# Altium project PCB_Project.PrjPcb
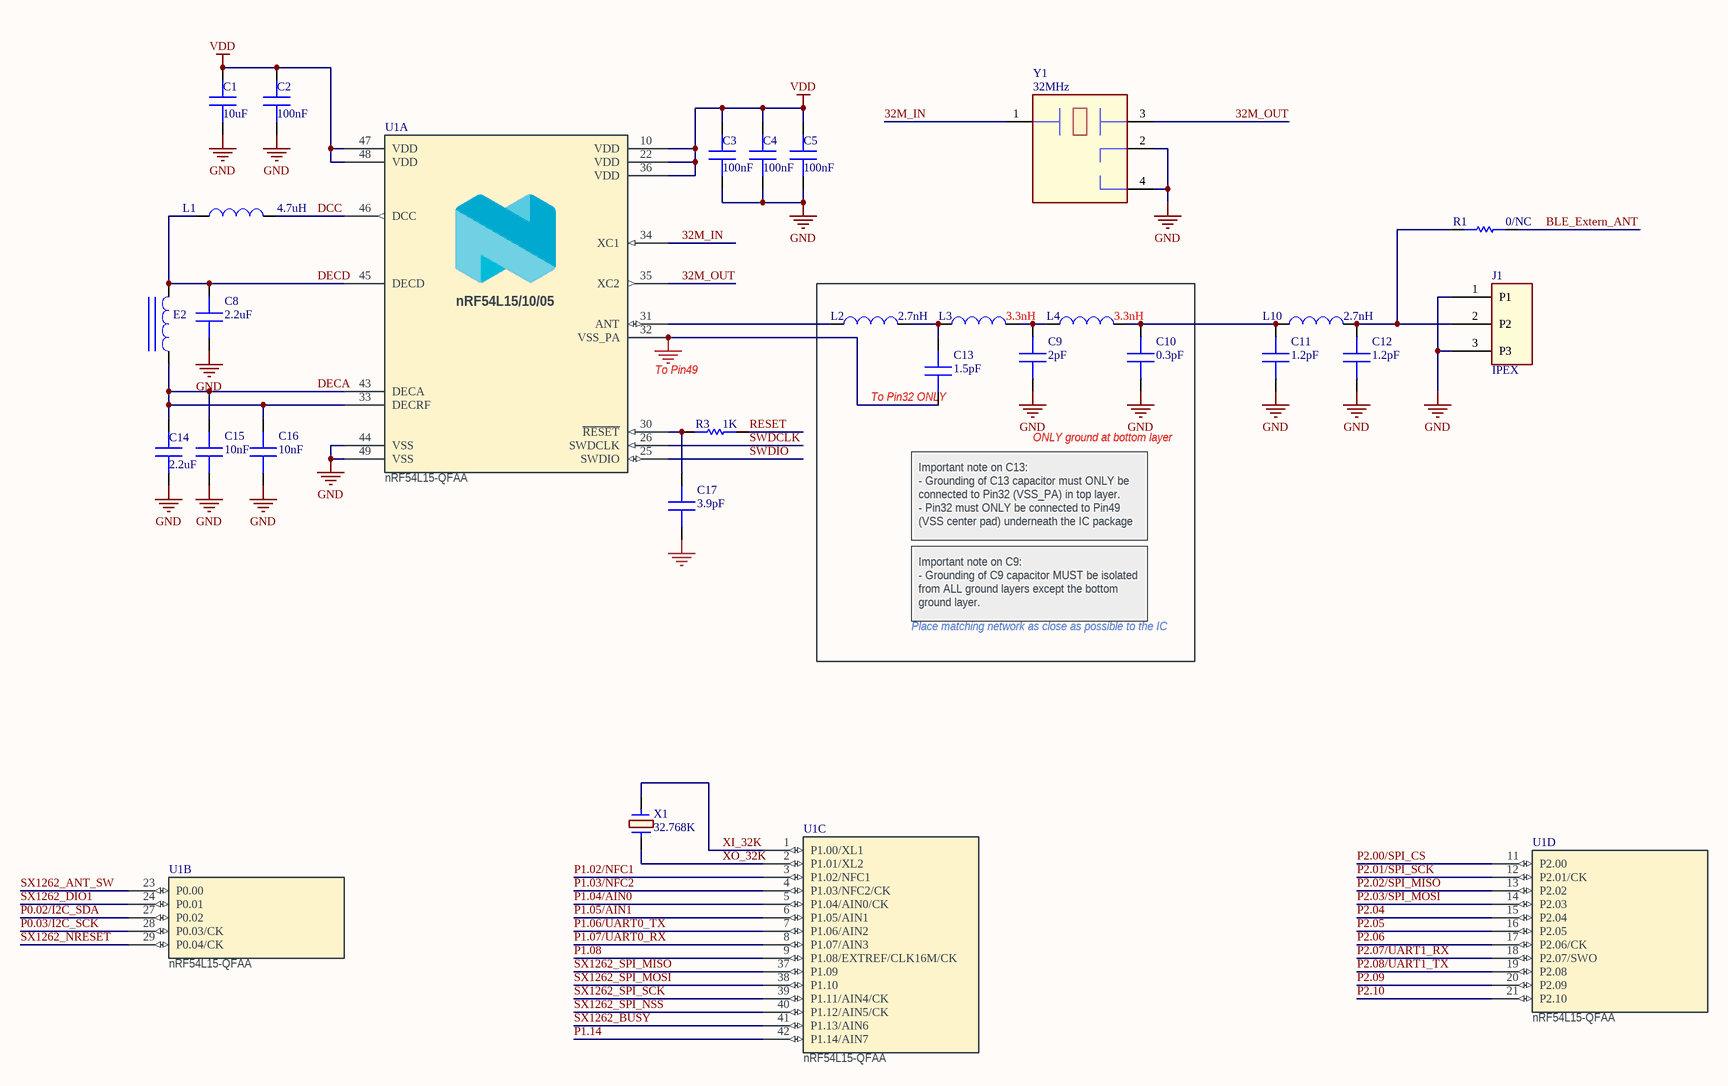
[diagram p0: RAK3162_NRF54L15.SchDoc]
3 sheets, 68 parts. Net scope: global (net labels, ports and power ports of the same name join across sheets).
Board file: RAK3162_260121_1.PcbDoc
Sheets:
  RAK3162_NRF54L15.SchDoc
  RAK3162_Pinout.SchDoc
  RAK3162_SX1262.SchDoc

## Sheet RAK3162_NRF54L15.SchDoc
size A3; SheetNumber: 1; SheetTotal: 3; PCBA_CODE: 8262XXXX

### Parts
C1  value 10uF  [sc0402]  (hidden comment: CAPACITOR NP)
C2  value 100nF  [sc0201]  (hidden comment: CAPACITOR NP)
C3  value 100nF  [sc0201]  (hidden comment: CAPACITOR NP)
C4  value 100nF  [sc0201]  (hidden comment: CAPACITOR NP)
C5  value 100nF  [sc0201]  (hidden comment: CAPACITOR NP)
C8  value 2.2uF  [sc0201]  (hidden comment: CAPACITOR NP)
C9  value 2pF  [sc0201]  (hidden comment: CAPACITOR NP)
C10  value 0.3pF  [sc0201]  (hidden comment: CAPACITOR NP)
C11  value 1.2pF  [sc0201]  (hidden comment: CAPACITOR NP)
C12  value 1.2pF  [sc0201]  (hidden comment: CAPACITOR NP)
C13  value 1.5pF  [sc0201]  (hidden comment: CAPACITOR NP)
C14  value 2.2uF  [sc0201]  (hidden comment: CAPACITOR NP)
C15  value 10nF  [sc0201]  (hidden comment: CAPACITOR NP)
C16  value 10nF  [sc0201]  (hidden comment: CAPACITOR NP)
C17  value 3.9pF  [sc0201]  (hidden comment: CAPACITOR NP)
E2  BEAD  [SL0201]  (value not drawn)
J1  value IPEX  [SCOXSMA_T]  (hidden comment: UFL)
L1  value 4.7uH  [SL0603]  (hidden comment: INDUCTOR)
L2  value 2.7nH  [sl0201]  (hidden comment: INDUCTOR)
L3  value 3.3nH  [sl0201]  (hidden comment: INDUCTOR)
L4  value 3.3nH  [sl0201]  (hidden comment: INDUCTOR)
L10  value 2.7nH  [sl0201]  (hidden comment: INDUCTOR)
R1  value 0/NC  [sr0201]  (hidden comment: RESISTOR)
R3  value 1K  [sr0201]  (hidden comment: RESISTOR)
U1  nRF54L15-QFAA  [QFN40P600X600X90-48N]  (parts A,B,C,D of 4)
X1  32.768K  [CM212H]
Y1  value 32MHz  [S0SC4-2016]  (hidden comment: CRYSTAL_4P)

### Nets
GND: C1.1(POS) C2.1(POS) C3.1(POS) C4.1(POS) C5.1(POS) C8.1(POS) C9.1(POS) C10.1(POS) C11.1(POS) C12.1(POS) C13.1(POS) C14.1(POS) C15.1(POS) C16.1(POS) C17.1(POS) J1.1(P1) J1.3(P3) U1.32(VSS_PA) U1.44(VSS) U1.49(VSS) Y1.2(GND1) Y1.4(GND2)
VDD: C1.2(NEG) C2.2(NEG) C3.2(NEG) C4.2(NEG) C5.2(NEG) U1.10(VDD) U1.22(VDD) U1.36(VDD) U1.47(VDD) U1.48(VDD)
32M_IN: U1.34(XC1) Y1.1(H1)
32M_OUT: U1.35(XC2) Y1.3(H2)
BLE_Extern_ANT: R1.1
DCC: L1.2 U1.46(DCC)
DECA: C14.2(NEG) C15.2(NEG) C16.2(NEG) E2.1 U1.33(DECRF) U1.43(DECA)
DECD: C8.2(NEG) E2.2 L1.1 U1.45(DECD)
P0.02/I2C_SDA: U1.27(P0.02)
P0.03/I2C_SCK: U1.28(P0.03/CK)
P1.02/NFC1: U1.3(P1.02/NFC1)
P1.03/NFC2: U1.4(P1.03/NFC2/CK)
P1.04/AIN0: U1.5(P1.04/AIN0/CK)
P1.05/AIN1: U1.6(P1.05/AIN1)
P1.06/UART0_TX: U1.7(P1.06/AIN2)
P1.07/UART0_RX: U1.8(P1.07/AIN3)
P1.08: U1.9(P1.08/EXTREF/CLK16M/CK)
P1.14: U1.42(P1.14/AIN7)
P2.00/SPI_CS: U1.11(P2.00)
P2.01/SPI_SCK: U1.12(P2.01/CK)
P2.02/SPI_MISO: U1.13(P2.02)
P2.03/SPI_MOSI: U1.14(P2.03)
P2.04: U1.15(P2.04)
P2.05: U1.16(P2.05)
P2.06: U1.17(P2.06/CK)
P2.07/UART1_RX: U1.18(P2.07/SWO)
P2.08/UART1_TX: U1.19(P2.08)
P2.09: U1.20(P2.09)
P2.10: U1.21(P2.10)
RESET: R3.1
SWDCLK: U1.26(SWDCLK)
SWDIO: U1.25(SWDIO)
SX1262_ANT_SW: U1.23(P0.00)
SX1262_BUSY: U1.41(P1.13/AIN6)
SX1262_DIO1: U1.24(P0.01)
SX1262_NRESET: U1.29(P0.04/CK)
SX1262_SPI_MISO: U1.37(P1.09)
SX1262_SPI_MOSI: U1.38(P1.10)
SX1262_SPI_NSS: U1.40(P1.12/AIN5/CK)
SX1262_SPI_SCK: U1.39(P1.11/AIN4/CK)
XI_32K: U1.1(P1.00/XL1) X1.2
XO_32K: U1.2(P1.01/XL2) X1.1
NetC9_2: C9.2(NEG) L3.2 L4.1
NetC10_2: C10.2(NEG) C11.2(NEG) L4.2 L10.1
NetC12_2: C12.2(NEG) J1.2(P2) L10.2 R1.2
NetC13_2: C13.2(NEG) L2.2 L3.1
NetC17_2: C17.2(NEG) R3.2 U1.30(~{RESET})
NetL2_1: L2.1 U1.31(ANT)

### Notes on the sheet
- (near U1) To Pin49
- (near C13) To Pin32 ONLY
- ONLY ground at bottom layer
- Important note on C13:
  - Grounding of C13 capacitor must ONLY be connected to Pin32 (VSS_PA) in top layer.
  - Pin32 must ONLY be connected to Pin49 (VSS center pad) underneath the IC package
- Important note on C9:
  - Grounding of C9 capacitor MUST be isolated from ALL ground layers except the bottom ground layer.
- Place matching network as close as possible to the IC
- Title
- Size:
- Engineer:
- A3
- Revision:
- Date:
- Sheet
- of
- (in symbol nRF54L15-QFAA, part A) nRF54L15/10/05

### Library data of the parts
C1 = 0807C004: Capacitor-10V-10uF-±20%-X5R-0402; MANUFACTURER: YAGEO; Part Number: CC0402MRX5R6BB106; TOLERANCE: ±20%; SYMNAME: CAP; VOLTAGE: 10V; RAK Code: KRAKBJ0807C004; Classification: SMD Ceramic Capacitor; CODE: 0807C004
C2-C5 = 0807B00F: Capacitor-6.3V-100nF-±10%-X5R-0201; MANUFACTURER: YAGEO; Part Number: CC0201KRX5R5BB104; TOLERANCE: ±10%; SYMNAME: CAP; VOLTAGE: 6.3V; RAK Code: K3CA10402KA201; Classification: SMD Ceramic Capacitor; CODE: 0807B00F
C8 C14 = 0807C02F: Capacitor-6.3V-2.2uF-±20%-X5R-0201; MANUFACTURER: YAGEO; Part Number: CC0201MRX5R5BB225; TOLERANCE: ±20%; SYMNAME: CAP; VOLTAGE: 6.3V; RAK Code: KRAKBJ0807C02F; Classification: SMD Ceramic Capacitor; CODE: 0807C02F
C9 = 0807C02M: Capacitor-50V-2pF-±0.1pF-COG-0201; MANUFACTURER: 深圳市宇阳科技发展有限公司; Part Number: C0201COG2R0B500NTA; TOLERANCE: ±0.1pF; SYMNAME: CAP; VOLTAGE: 50V; Classification: SMD Ceramic Capacitor; CODE: 0807C02M
C10 = 0807B00M: Capacitor-50V-0.3pF-±0.1pF-NPO-0201; MANUFACTURER: YAGEO; Part Number: CC0201BRNPO9BNR30; TOLERANCE: ±0.1pF; SYMNAME: CAP; VOLTAGE: 50V; RAK Code: KRAKBJ0807B00M; Classification: SMD Ceramic Capacitor; CODE: 0807B00M
C11 C12 = 0807B00L: Capacitor-50V-1.2pF-±0.1pF-COG-0201; MANUFACTURER: MuRATA; Part Number: GRM0335C1H1R2BA01D; TOLERANCE: ±0.1pF; SYMNAME: CAP; VOLTAGE: 50V; RAK Code: KRAKBJ0807B00L; Classification: SMD Ceramic Capacitor; CODE: 0807B00L
C13 = 0807B00Q: Capacitor-50V-1.5pF-±0.25pF-COG-0201; MANUFACTURER: YAGEO; Part Number: CC0201CRNPO9BN1R5; TOLERANCE: ±0.25pF; SYMNAME: CAP; VOLTAGE: 50V; RAK Code: KRAKBJ0807B00Q; Classification: SMD Ceramic Capacitor; CODE: 0807B00Q
C15 C16 = 0807B00H: Capacitor-10V-10nF-±10%-X7R-0201; MANUFACTURER: YAGEO; Part Number: CC0201KRX7R6BB103; TOLERANCE: ±10%; SYMNAME: CAP; VOLTAGE: 10V; RAK Code: K3CA10303KA201; Classification: SMD Ceramic Capacitor; CODE: 0807B00H
C17 = 0807C00E: Capacitor-50V-3.9pF-±0.25pF-NPO-0201; MANUFACTURER: YAGEO; Part Number: CC0201CRNPO9BN3R9; TOLERANCE: ±0.25pF; SYMNAME: CAP; VOLTAGE: 50V; RAK Code: KRAKBJ0807C00E; Classification: SMD Ceramic Capacitor; CODE: 0807C00E
E2 = 1007C00B: EMI Ferrite Bead-240Ω±25%@100MHz-0.38Ω-350mA-0201; MANUFACTURER: Murata; Part Number: BLM03AX241SN1D; Current: 350mA; Value: 0.38ohm; Tolerance: ±25%; CODE: 1007C00B; Classification: Bead
J1 = 1404A001: Coaxial Connectors-IPEX MHF1-Receptacle, Male Pin-50Ohm-Surface Mount; MANUFACTURER: BLDZ01; PART_NUMBER: ECT818000071; Part Number: L10-03001-01; RAK Code: K6PRUFLRSMT101; CODE: 1404A001; Classification: Coaxial Connectors
L1 = 1003C02M: Power Inductor-4.7uH-±20%-0.5Ω-120mA-0603; MANUFACTURER: TDK; Part Number: MLZ1608M4R7WT000; Current: 120mA; Tolerance: ±20%; Classification: SMD Inductor; CODE: 1003C02M
L2 L10 = 1003B00N: Inductor-2.7nH-±0.1nH-0.2Ω-500mA-0201; MANUFACTURER: MURATA; Part Number: LQP03TN2N7B02D; RAK Code: K3LA027A05A201; Tolerance: ±0.1nH; Classification: SMD Inductor; CODE: 1003B00N
L3 L4 = 1003B00E: Inductor-3.3nH-±0.1nH-0.25Ω-450mA-0201; MANUFACTURER: MURATA; Part Number: LQP03TN3N3B02; RAK Code: KRAKBJ1003B00E; Tolerance: ±0.1nH; Classification: SMD Inductor; CODE: 1003B00E
R1 = 0709B00M: Resistor-0Ω-0.5A-50mΩMAX-0201; MANUFACTURER: YAGEO; Part Number: RC0201JR-070RL; RAK Code: K3RS00000JA201; Classification: Thick Film Resistor; CODE: 0709B00M; Tolerance: 50mΩMAX
R3 = 0709B01A: Resistor-1/20W-1KΩ-±1%-0201; MANUFACTURER: YAGEO; Part Number: RC0201FR-071KL; RAK Code: KRAKBJ0709B01A; Tolerance: ±1%; Classification: Thick Film Resistor; CODE: 0709B01A
U1 = nRF54L15-QFAA: Manufacturer: Nordic Semiconductor; Part number NEMS: 102000370; Component Status: Active; Pad Count: 49; Note: N.A.; Part Number: nRF54L15-QFAA; PartId: 102000370; Component Class: Nordic_Devices; Author: stl1; Manufacturer Part Number: nRF54L15-QFAA; ComponentLink1URL: N.A.; ComponentLink1Description: Datasheet; ComponentLink2URL: N.A.; ComponentLink2Description: Supplier link; HelpURL: N.A.; LatestRevisionDate: 2024-11-27; Published: 2024-11-27; Footprint Doc: QFN-48; Supplier 1: Nordic Semiconductor; Supplier Part Number 1: nRF54L15-QFAA; Supplier 2: N.A.; Supplier Part Number 2: N.A.; Artikkelnr Noca: N.A.; Part number IPS: N.A.; Part number Norautron: N.A.; Value: nRF54L15-QFAA
X1 = 1202C005: Crystal-32.768KHz-12.5pF-±20ppm-−40~+85℃-SMD-2012-2pin; Manufacturer: XTCS01; PSpiceTemplate: X^@REFDES %1 %2 @MODEL; RAK Code: KRAKBJ1202C005; Tolerance: ±20ppm; Value: 32.768K; Code: 1202C005; Part Number: CM212H; Classification: Crystal
Y1 = 1202B004: Crystal-32MHz-6pF-±20ppm-70Ω-SMD-2016-4pin; MANUFACTURER: MURATA; Part Number: XRCGB32M000F2P10R0; RAK Code: KRAKBJ1202B004; Tolerance: ±20ppm; CODE: 1202B004; SYMNAME: CRYSTAL_4P; Classification: Crystal

## Sheet RAK3162_Pinout.SchDoc
size A4; SheetNumber: 3; SheetTotal: 3; PCBA_CODE: 8262XXXX
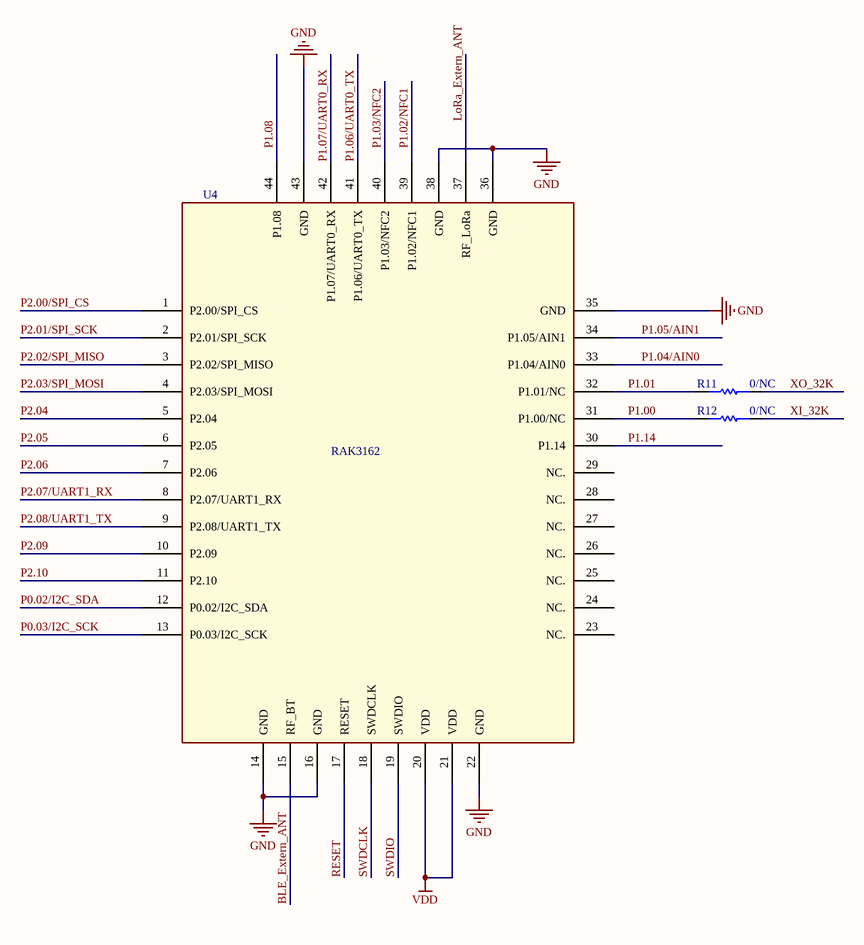
[diagram p1: RAK3162_Pinout.SchDoc]

### Parts
R11  value 0/NC  [sr0201]  (hidden comment: RESISTOR)
R12  value 0/NC  [sr0201]  (hidden comment: RESISTOR)
U4  RAK3162  [RAK4630_PINOUT]

### Nets
GND: U4.14(GND) U4.16(GND) U4.22(GND) U4.35(GND) U4.36(GND) U4.38(GND) U4.43(GND)
VDD: U4.20(VDD) U4.21(VDD)
BLE_Extern_ANT: U4.15(RF_BT)
LoRa_Extern_ANT: U4.37(RF_LoRa)
P0.02/I2C_SDA: U4.12(P0.02/I2C_SDA)
P0.03/I2C_SCK: U4.13(P0.03/I2C_SCK)
P1.00: R12.2 U4.31(P1.00/NC)
P1.01: R11.2 U4.32(P1.01/NC)
P1.02/NFC1: U4.39(P1.02/NFC1)
P1.03/NFC2: U4.40(P1.03/NFC2)
P1.04/AIN0: U4.33(P1.04/AIN0)
P1.05/AIN1: U4.34(P1.05/AIN1)
P1.06/UART0_TX: U4.41(P1.06/UART0_TX)
P1.07/UART0_RX: U4.42(P1.07/UART0_RX)
P1.08: U4.44(P1.08)
P1.14: U4.30(P1.14)
P2.00/SPI_CS: U4.1(P2.00/SPI_CS)
P2.01/SPI_SCK: U4.2(P2.01/SPI_SCK)
P2.02/SPI_MISO: U4.3(P2.02/SPI_MISO)
P2.03/SPI_MOSI: U4.4(P2.03/SPI_MOSI)
P2.04: U4.5(P2.04)
P2.05: U4.6(P2.05)
P2.06: U4.7(P2.06)
P2.07/UART1_RX: U4.8(P2.07/UART1_RX)
P2.08/UART1_TX: U4.9(P2.08/UART1_TX)
P2.09: U4.10(P2.09)
P2.10: U4.11(P2.10)
RESET: U4.17(RESET)
SWDCLK: U4.18(SWDCLK)
SWDIO: U4.19(SWDIO)
XI_32K: R12.1
XO_32K: R11.1

Not connected (* = marked no-connect by the designer): U4 23(NC.) 24(NC.) 25(NC.) 26(NC.) 27(NC.) 28(NC.) 29(NC.)

### Notes on the sheet
- Title
- Size:
- Engineer:
- A4
- Revision:
- Date:
- Sheet
- of

### Library data of the parts
R11 R12 = 0709B00M: as R1 on sheet RAK3162_NRF54L15; CODE: 0709B00M; Tolerance: 50mΩMAX

## Sheet RAK3162_SX1262.SchDoc
size A3; SheetNumber: 2; SheetTotal: 3; PCBA_CODE: 8262XXXX
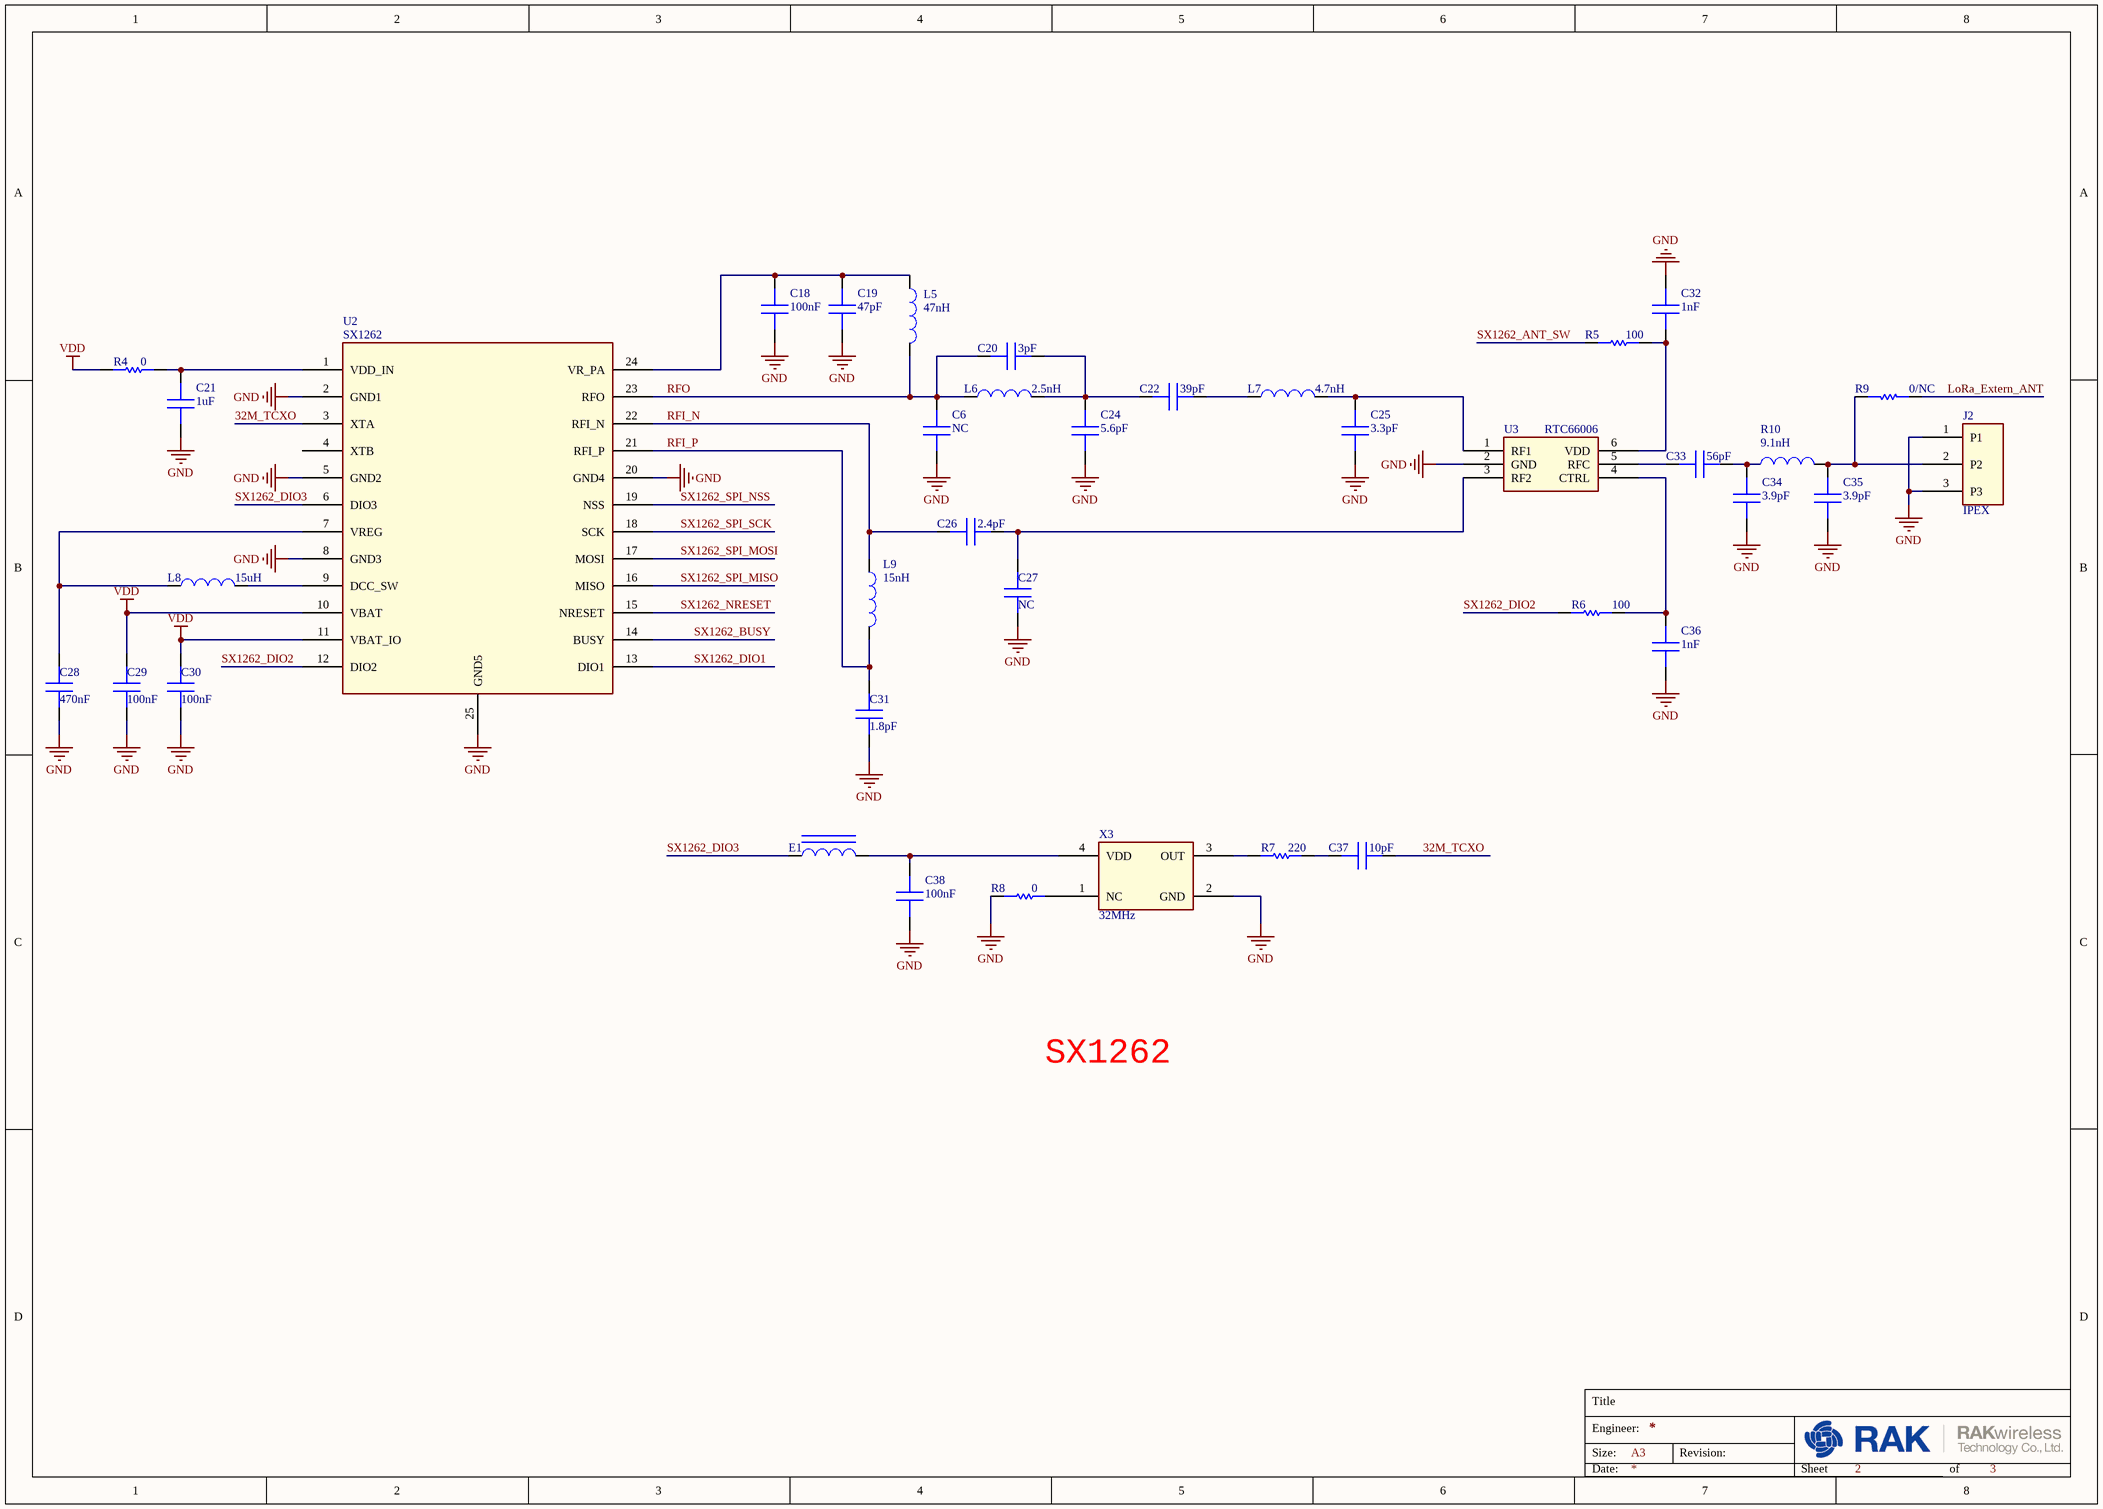
[diagram p2: RAK3162_SX1262.SchDoc]

### Parts
C6  value NC  [sc0201]  (hidden comment: CAPACITOR NP)
C18  value 100nF  [sc0201]  (hidden comment: CAPACITOR NP)
C19  value 47pF  [sc0201]  (hidden comment: CAPACITOR NP)
C20  value 3pF  [sc0201]  (hidden comment: CAPACITOR NP)
C21  value 1uF  [sc0201]  (hidden comment: CAPACITOR NP)
C22  value 39pF  [sc0201]  (hidden comment: CAPACITOR NP)
C24  value 5.6pF  [sc0201]  (hidden comment: CAPACITOR NP)
C25  value 3.3pF  [sc0201]  (hidden comment: CAPACITOR NP)
C26  value 2.4pF  [sc0201]  (hidden comment: CAPACITOR NP)
C27  value NC  [sc0201]  (hidden comment: CAPACITOR NP)
C28  value 470nF  [sc0201]  (hidden comment: CAPACITOR NP)
C29  value 100nF  [sc0201]  (hidden comment: CAPACITOR NP)
C30  value 100nF  [sc0201]  (hidden comment: CAPACITOR NP)
C31  value 1.8pF  [sc0201]  (hidden comment: CAPACITOR NP)
C32  value 1nF  [sc0201]  (hidden comment: CAPACITOR NP)
C33  value 56pF  [sc0201]  (hidden comment: CAPACITOR NP)
C34  value 3.9pF  [sc0201]  (hidden comment: CAPACITOR NP)
C35  value 3.9pF  [sc0201]  (hidden comment: CAPACITOR NP)
C36  value 1nF  [sc0201]  (hidden comment: CAPACITOR NP)
C37  value 10pF  [sc0201]  (hidden comment: CAPACITOR NP)
C38  value 100nF  [sc0201]  (hidden comment: CAPACITOR NP)
E1  BEAD  [SL0201]  (value not drawn)
J2  value IPEX  [SCOXSMA_T]  (hidden comment: UFL)
L5  value 47nH  [SL0402]  (hidden comment: INDUCTOR)
L6  value 2.5nH  [sl0201]  (hidden comment: INDUCTOR)
L7  value 4.7nH  [sl0201]  (hidden comment: INDUCTOR)
L8  value 15uH  [SL0805]  (hidden comment: INDUCTOR)
L9  value 15nH  [sl0201]  (hidden comment: INDUCTOR)
R4  value 0  [sr0201]  (hidden comment: RESISTOR)
R5  value 100  [sr0201]  (hidden comment: RESISTOR)
R6  value 100  [sr0201]  (hidden comment: RESISTOR)
R7  value 220  [sr0201]  (hidden comment: RESISTOR)
R8  value 0  [sr0201]  (hidden comment: RESISTOR)
R9  value 0/NC  [sr0201]  (hidden comment: RESISTOR)
R10  value 9.1nH  [sl0201]  (hidden comment: INDUCTOR)
U2  value SX1262  [VQFN24_4X4MM]  (hidden comment: SX126X)
U3  value RTC66006  [SC-70-6]  (hidden comment: PE4259)
X3  value 32MHz  [S0SC4-2016]  (hidden comment: 32M-TXCO)

### Nets
GND: C6.1(POS) C18.1(POS) C19.1(POS) C21.1(POS) C24.1(POS) C25.1(POS) C27.1(POS) C28.1(POS) C29.1(POS) C30.1(POS) C31.1(POS) C32.2(NEG) C34.1(POS) C35.1(POS) C36.1(POS) C38.1(POS) J2.1(P1) J2.3(P3) R8.2 U2.2(GND1) U2.5(GND2) U2.8(GND3) U2.20(GND4) U2.25(GND5) U3.2(GND) X3.2(GND)
VDD: C29.2(NEG) C30.2(NEG) R4.2 U2.10(VBAT) U2.11(VBAT_IO)
32M_TCXO: C37.2(NEG) U2.3(XTA)
LoRa_Extern_ANT: R9.1
RFI_N: C26.1(POS) L9.1 U2.22(RFI_N)
RFI_P: C31.2(NEG) L9.2 U2.21(RFI_P)
RFO: C6.2(NEG) C20.1(POS) L5.2 L6.1 U2.23(RFO)
SX1262_ANT_SW: R5.2
SX1262_BUSY: U2.14(BUSY)
SX1262_DIO1: U2.13(DIO1)
SX1262_DIO2: R6.2 U2.12(DIO2)
SX1262_DIO3: E1.1 U2.6(DIO3)
SX1262_NRESET: U2.15(NRESET)
SX1262_SPI_MISO: U2.16(MISO)
SX1262_SPI_MOSI: U2.17(MOSI)
SX1262_SPI_NSS: U2.19(NSS)
SX1262_SPI_SCK: U2.18(SCK)
NetC18_2: C18.2(NEG) C19.2(NEG) L5.1 U2.24(VR_PA)
NetC20_2: C20.2(NEG) C22.1(POS) C24.2(NEG) L6.2
NetC21_2: C21.2(NEG) R4.1 U2.1(VDD_IN)
NetC22_2: C22.2(NEG) L7.1
NetC25_2: C25.2(NEG) L7.2 U3.1(RF1)
NetC26_2: C26.2(NEG) C27.2(NEG) U3.3(RF2)
NetC28_2: C28.2(NEG) L8.1 U2.7(VREG)
NetC32_1: C32.1(POS) R5.1 U3.6(VDD)
NetC33_1: C33.1(POS) U3.5(RFC)
NetC33_2: C33.2(NEG) C34.2(NEG) R10.1
NetC35_2: C35.2(NEG) J2.2(P2) R9.2 R10.2
NetC36_2: C36.2(NEG) R6.1 U3.4(CTRL)
NetC37_1: C37.1(POS) R7.1
NetC38_2: C38.2(NEG) E1.2 X3.4(VDD)
NetL8_2: L8.2 U2.9(DCC_SW)
NetR7_2: R7.2 X3.3(OUT)
NetR8_1: R8.1 X3.1(NC)

Not connected (* = marked no-connect by the designer): U2 4(XTB)

### Notes on the sheet
- SX1262
- Title
- Size:
- Engineer:
- A3
- Revision:
- Date:
- Sheet
- of

### Library data of the parts
C6 C24 = 0807C00D: Capacitor-50V-5.6pF-±0.25pF-COG-0201; MANUFACTURER: MURATA; Part Number: GRM0335C1H5R6CA01D; TOLERANCE: ±0.25pF; SYMNAME: CAP; VOLTAGE: 50V; RAK Code: KRAKBJ0807C00D; Classification: SMD Ceramic Capacitor; CODE: 0807C00D
C18 C29 C30 C38 = 0807B00F: as C2 on sheet RAK3162_NRF54L15; CODE: 0807B00F
C19 C27 = 0807C00G: Capacitor-25V-47pF-±5%-NPO-0201; MANUFACTURER: YAGEO; Part Number: CC0201JRNPO8BN470; TOLERANCE: ±5%; SYMNAME: CAP; VOLTAGE: 25V; RAK Code: KRAKBJ0807C00G; Classification: SMD Ceramic Capacitor; CODE: 0807C00G
C20 = 0807C00X: Capacitor-50V-3pF-±0.25pF-NPO-0201; MANUFACTURER: YAGEO; Part Number: CC0201CRNPO9BN3R0; TOLERANCE: ±0.25pF; SYMNAME: CAP; VOLTAGE: 50V; RAK Code: KRAKBJ0807C00X; Classification: SMD Ceramic Capacitor; CODE: 0807C00X
C21 = 0807B00G: Capacitor-6.3V-1uF-±20%-X5R-0201; MANUFACTURER: YAGEO; Part Number: CC0201MRX5R5BB105; TOLERANCE: ±20%; SYMNAME: CAP; VOLTAGE: 6.3V; RAK Code: KRAKBJ0807B00G; Classification: SMD Ceramic Capacitor; CODE: 0807B00G
C22 = 0807C011: Capacitor-25V-39pF-±5%-NPO-0201; MANUFACTURER: YAGEO; Part Number: CC0201JRNPO8BN390; TOLERANCE: ±5%; SYMNAME: CAP; VOLTAGE: 25V; RAK Code: KRAKBJ0807C011; Classification: SMD Ceramic Capacitor; CODE: 0807C011
C25 = 0807B01B: Capacitor-50V-3.3pF-±0.25pF-NPO-0201; MANUFACTURER: YAGEO; Part Number: CC0201CRNPO9BN3R3; TOLERANCE: ±0.25pF; SYMNAME: CAP; VOLTAGE: 50V; RAK Code: KRAKBJ0807B01B; Classification: SMD Ceramic Capacitor; CODE: 0807B01B
C26 = 0807C010: Capacitor-50V-2.4pF-±0.25pF-NPO-0201; MANUFACTURER: YAGEO; Part Number: CC0201CRNPO9BN2R4; TOLERANCE: ±0.25pF; SYMNAME: CAP; VOLTAGE: 50V; RAK Code: KRAKBJ0807C010; Classification: SMD Ceramic Capacitor; CODE: 0807C010
C28 = 0807C02P: Capacitor-6.3V-470nF-±20%-X5R-0201; MANUFACTURER: MURATA; Part Number: GRM033R60J474ME90J; TOLERANCE: ±20%; SYMNAME: CAP; VOLTAGE: 6.3V; Classification: SMD Ceramic Capacitor; CODE: 0807C02P
C31 = 0807B00W: Capacitor-50V-1.8pF-±0.25pF-NPO-0201; MANUFACTURER: YAGEO; Part Number: CC0201CRNPO9BN1R8; TOLERANCE: ±0.25pF; SYMNAME: CAP; VOLTAGE: 50V; RAK Code: K3CA22A06CA201; Classification: SMD Ceramic Capacitor; CODE: 0807B00W
C32 C36 = 0807B00T: Capacitor-25V-1nF-±10%-X7R-0201; MANUFACTURER: YAGEO; Part Number: CC0201KRX7R8BB102; TOLERANCE: ±10%; SYMNAME: CAP; VOLTAGE: 25V; RAK Code: K3CA10204KA201; Classification: SMD Ceramic Capacitor; CODE: 0807B00T
C33 = 0807C02R: Capacitor-25V-56pF-±5%-NPO-0201; MANUFACTURER: 华新科技(WALSIN); Part Number: 0201N560J250CT; TOLERANCE: ±5%; SYMNAME: CAP; VOLTAGE: 25V; Classification: SMD Ceramic Capacitor; CODE: 0807C02R
C34 C35 = 0807C00E: as C17 on sheet RAK3162_NRF54L15; CODE: 0807C00E
C37 = 0807B00J: Capacitor-50V-10pF-±5%-NPO-0201; MANUFACTURER: YAGEO; Part Number: CC0201JRNPO9BN100; TOLERANCE: ±5%; SYMNAME: CAP; VOLTAGE: 50V; RAK Code: K3CA10006JA201; Classification: SMD Ceramic Capacitor; CODE: 0807B00J
E1 = 1007C00B: as E2 on sheet RAK3162_NRF54L15; CODE: 1007C00B; Classification: Bead
J2 = 1404A001: as J1 on sheet RAK3162_NRF54L15; CODE: 1404A001; Classification: Coaxial Connectors
L5 = 1003B01D: Inductor-47nH-±2%-1.15Ω-250mA-0402; MANUFACTURER: MURATA; Part Number: LQG15HN47NG02; RAK Code: KRAKBJ1003B01D; Current: 250mA; Tolerance: ±2%; Classification: SMD Inductor; CODE: 1003B01D
L6 = 1003C012: Inductor-2.5nH-±0.1nH-0.2Ω-500mA-0201; MANUFACTURER: MURATA; Part Number: LQP03TN2N5B02; RAK Code: KRAKBJ1003C012; Tolerance: ±0.1nH; Classification: SMD Inductor; CODE: 1003C012
L7 = 1003C00J: Inductor-4.7nH-±5%-0.4Ω-350mA-0201; MANUFACTURER: MURATA; Part Number: LQP03TN4N7J02D; RAK Code: KRAKBJ1003C00J; Current: 350mA; Tolerance: ±5%; Classification: SMD Inductor; CODE: 1003C00J
L8 = 1003C00V: Inductor-15uH-±20%-0.95Ω±30%-250mA-0805; MANUFACTURER: TDK; Part Number: MLZ2012M150WT000; RAK Code: KRAKBJ1003C00V; Current: 0.25A; Tolerance: ±20%; Classification: SMD Inductor; CODE: 1003C00V
L9 = 1003B00Y: Inductor-15nH-±5%-0.7Ω-250mA-0201; MANUFACTURER: MURATA; Part Number: LQP03TN15NJ02D; RAK Code: KRAKBJ1003B00Y; Tolerance: ±5%; Classification: SMD Inductor; CODE: 1003B00Y
R4 R8 R9 = 0709B00M: as R1 on sheet RAK3162_NRF54L15; CODE: 0709B00M; Tolerance: 50mΩMAX
R5 R6 = 0709B014: Resistor-1/20W-100Ω-±1%-0201; MANUFACTURER: YAGEO; Part Number: RC0201FR-07100RL; RAK Code: KRAKBJ0709B014; Tolerance: ±1%; Classification: Thick Film Resistor; CODE: 0709B014
R7 = 0709C03T: Resistor-1/20W-220Ω-±1%-0201; MANUFACTURER: YAGEO; Part Number: RC0201FR07-220RL; RAK Code: KRAKBJ0709C03T; Tolerance: ±1%; Classification: Thick Film Resistor; CODE: 0709C03T
R10 = 1003C013: Inductor-9.1nH-±3%-0.7Ω-250mA-0201; MANUFACTURER: MURATA; Part Number: LQP03TN9N1H02D; RAK Code: KRAKBJ1003C013; Tolerance: ±3%; Classification: SMD Inductor; CODE: 1003C013
U2 = 4715C009: RF IC-LoRa Transceiver-SX1262IMLTRT-150~960 MHz-22dBm-SF5 to SF12-1.8~3.7V-QFN24-4x4mm; Manufacturer: SEMTECH; RAK Code: KRAKBJ4715C009; Classification: LoRa PHY; Code: 4715C009; Part Number: SX1262IMLTRT
U3 = 4714C004: RF IC-RF Switch-PE4259-10~3000 MHz-SPDT-0.35 dB-30dB-SC-70-6; Manufacturer: PSEMI; RAK Code: K5BS0FE4259SC7; Code: 4714C004; Part Number: PE4259; Classification: RF Switch
X3 = 1202C003: Oscillator-32MHz-TCXO-±2ppm--30℃~85℃-1.8V~3.3V-SMD-2016-4pin; Manufacturer: NDK; Part Number: END4263A; RAK Code: KRAKBJ1202C003; Tolerance: ±2ppm; Code: 1202C003; Classification: Oscillator

## Nets that join several sheets
GND: RAK3162_NRF54L15 (22 pins), RAK3162_Pinout (7 pins), RAK3162_SX1262 (26 pins)
VDD: RAK3162_NRF54L15 (10 pins), RAK3162_Pinout (U4.20 U4.21), RAK3162_SX1262 (5 pins)
BLE_Extern_ANT: RAK3162_NRF54L15 (R1.1), RAK3162_Pinout (U4.15)
LoRa_Extern_ANT: RAK3162_Pinout (U4.37), RAK3162_SX1262 (R9.1)
P0.02/I2C_SDA: RAK3162_NRF54L15 (U1.27), RAK3162_Pinout (U4.12)
P0.03/I2C_SCK: RAK3162_NRF54L15 (U1.28), RAK3162_Pinout (U4.13)
P1.02/NFC1: RAK3162_NRF54L15 (U1.3), RAK3162_Pinout (U4.39)
P1.03/NFC2: RAK3162_NRF54L15 (U1.4), RAK3162_Pinout (U4.40)
P1.04/AIN0: RAK3162_NRF54L15 (U1.5), RAK3162_Pinout (U4.33)
P1.05/AIN1: RAK3162_NRF54L15 (U1.6), RAK3162_Pinout (U4.34)
P1.06/UART0_TX: RAK3162_NRF54L15 (U1.7), RAK3162_Pinout (U4.41)
P1.07/UART0_RX: RAK3162_NRF54L15 (U1.8), RAK3162_Pinout (U4.42)
P1.08: RAK3162_NRF54L15 (U1.9), RAK3162_Pinout (U4.44)
P1.14: RAK3162_NRF54L15 (U1.42), RAK3162_Pinout (U4.30)
P2.00/SPI_CS: RAK3162_NRF54L15 (U1.11), RAK3162_Pinout (U4.1)
P2.01/SPI_SCK: RAK3162_NRF54L15 (U1.12), RAK3162_Pinout (U4.2)
P2.02/SPI_MISO: RAK3162_NRF54L15 (U1.13), RAK3162_Pinout (U4.3)
P2.03/SPI_MOSI: RAK3162_NRF54L15 (U1.14), RAK3162_Pinout (U4.4)
P2.04: RAK3162_NRF54L15 (U1.15), RAK3162_Pinout (U4.5)
P2.05: RAK3162_NRF54L15 (U1.16), RAK3162_Pinout (U4.6)
P2.06: RAK3162_NRF54L15 (U1.17), RAK3162_Pinout (U4.7)
P2.07/UART1_RX: RAK3162_NRF54L15 (U1.18), RAK3162_Pinout (U4.8)
P2.08/UART1_TX: RAK3162_NRF54L15 (U1.19), RAK3162_Pinout (U4.9)
P2.09: RAK3162_NRF54L15 (U1.20), RAK3162_Pinout (U4.10)
P2.10: RAK3162_NRF54L15 (U1.21), RAK3162_Pinout (U4.11)
RESET: RAK3162_NRF54L15 (R3.1), RAK3162_Pinout (U4.17)
SWDCLK: RAK3162_NRF54L15 (U1.26), RAK3162_Pinout (U4.18)
SWDIO: RAK3162_NRF54L15 (U1.25), RAK3162_Pinout (U4.19)
SX1262_ANT_SW: RAK3162_NRF54L15 (U1.23), RAK3162_SX1262 (R5.2)
SX1262_BUSY: RAK3162_NRF54L15 (U1.41), RAK3162_SX1262 (U2.14)
SX1262_DIO1: RAK3162_NRF54L15 (U1.24), RAK3162_SX1262 (U2.13)
SX1262_NRESET: RAK3162_NRF54L15 (U1.29), RAK3162_SX1262 (U2.15)
SX1262_SPI_MISO: RAK3162_NRF54L15 (U1.37), RAK3162_SX1262 (U2.16)
SX1262_SPI_MOSI: RAK3162_NRF54L15 (U1.38), RAK3162_SX1262 (U2.17)
SX1262_SPI_NSS: RAK3162_NRF54L15 (U1.40), RAK3162_SX1262 (U2.19)
SX1262_SPI_SCK: RAK3162_NRF54L15 (U1.39), RAK3162_SX1262 (U2.18)
XI_32K: RAK3162_NRF54L15 (U1.1 X1.2), RAK3162_Pinout (R12.1)
XO_32K: RAK3162_NRF54L15 (U1.2 X1.1), RAK3162_Pinout (R11.1)